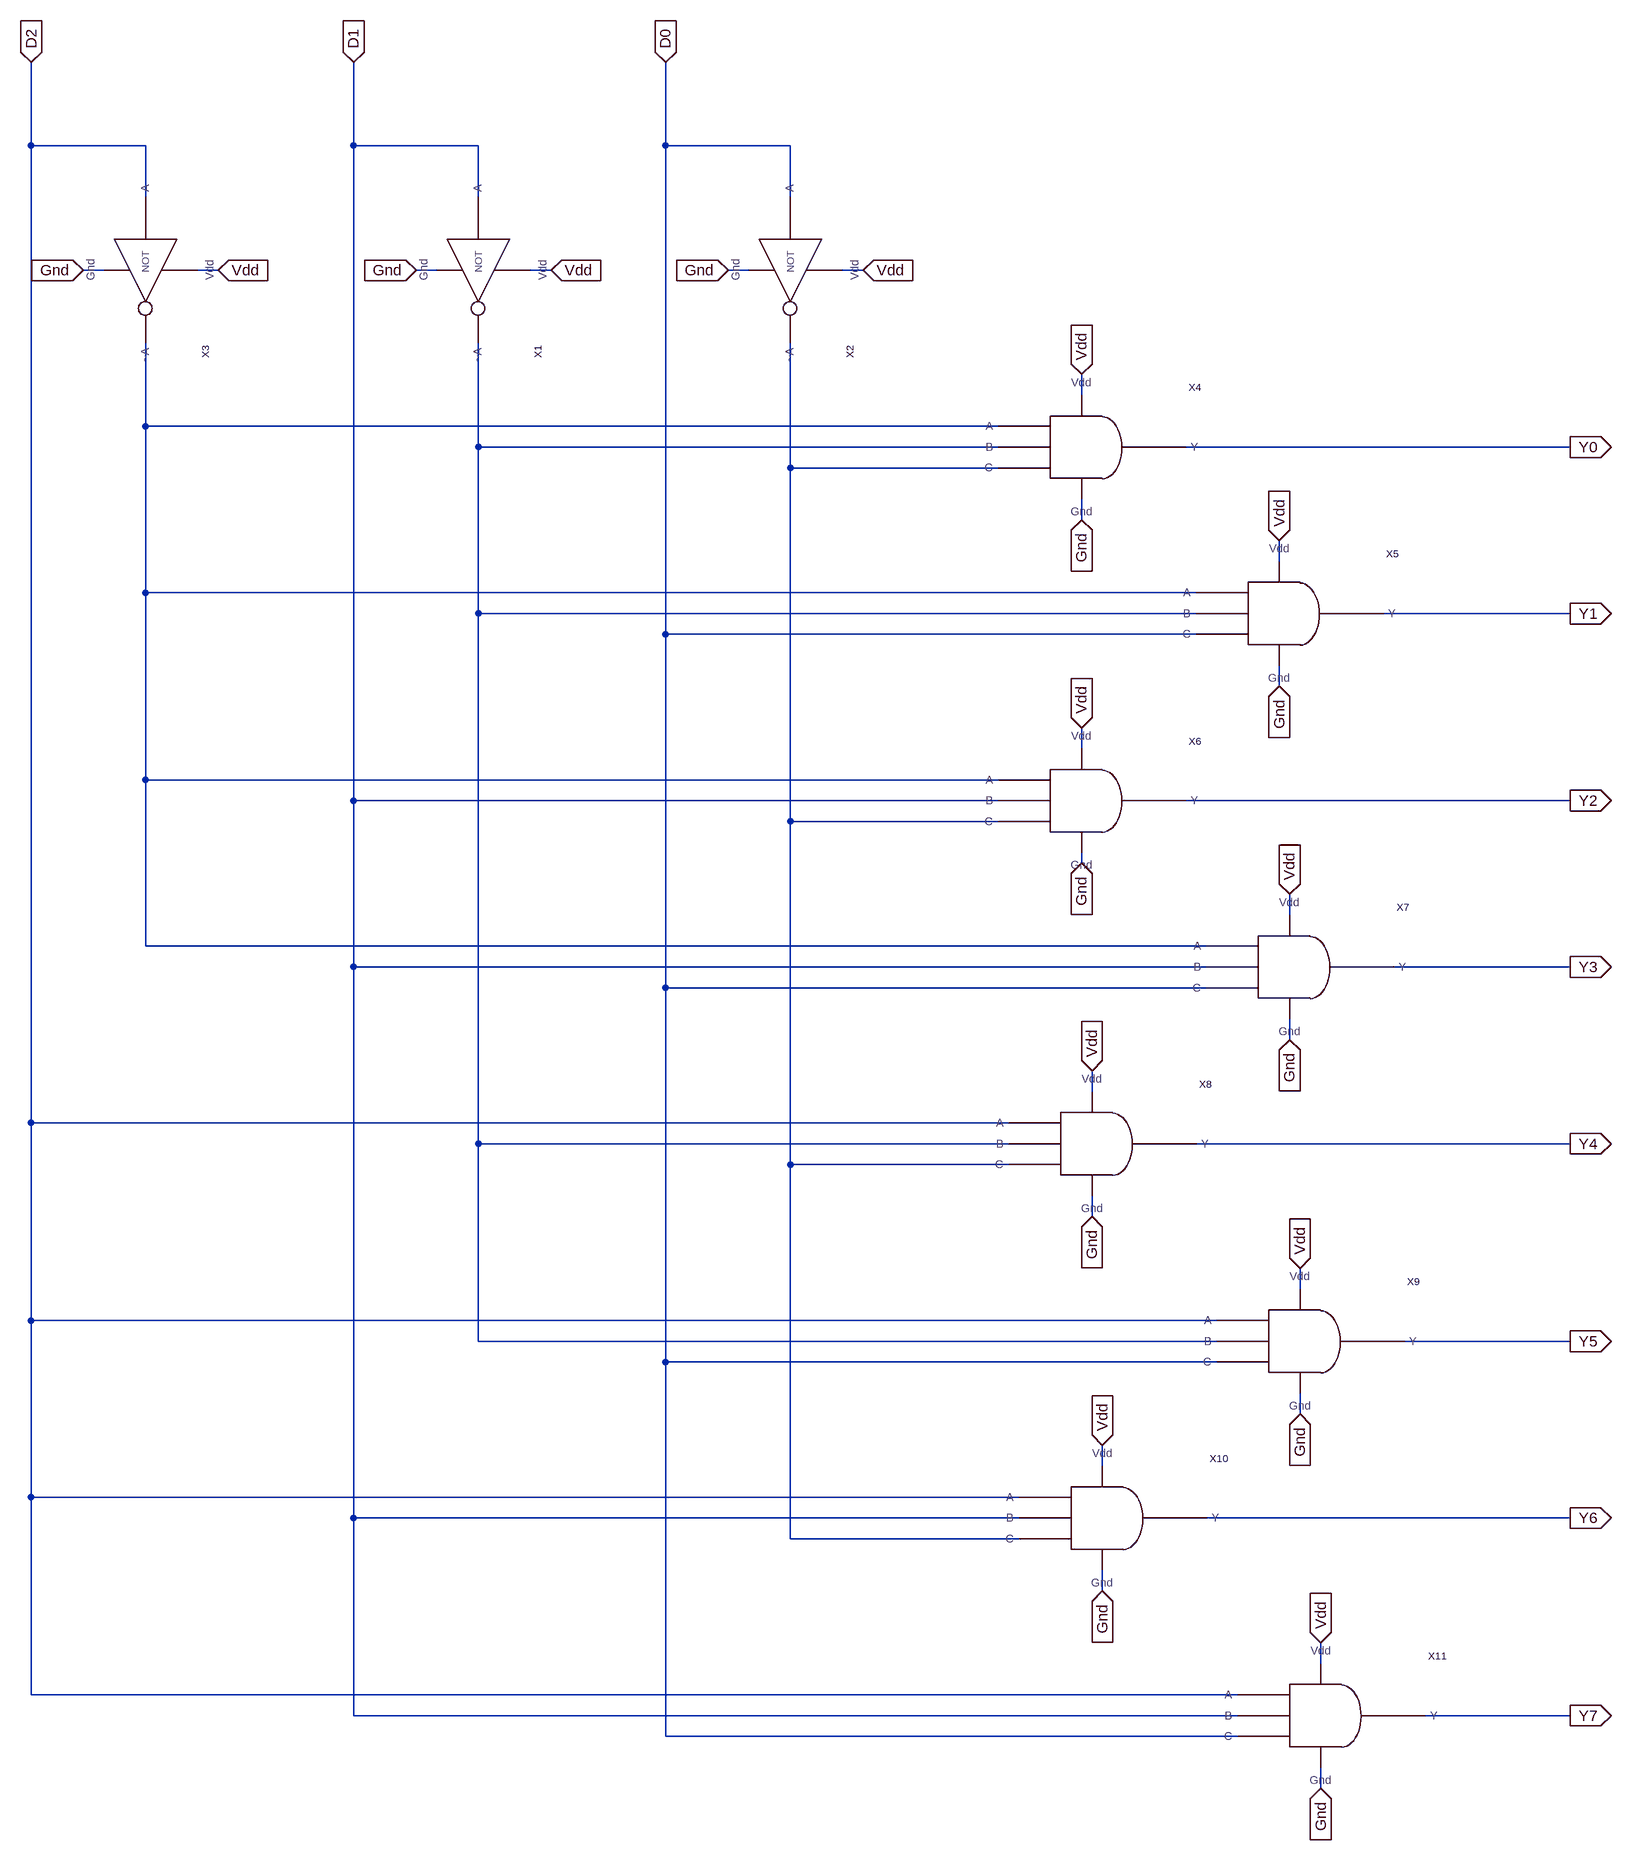
[diagram p0: schematic ALU_DEC.asc]
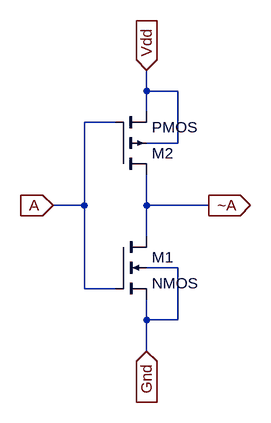
[diagram p1: sub-circuit not.asc]
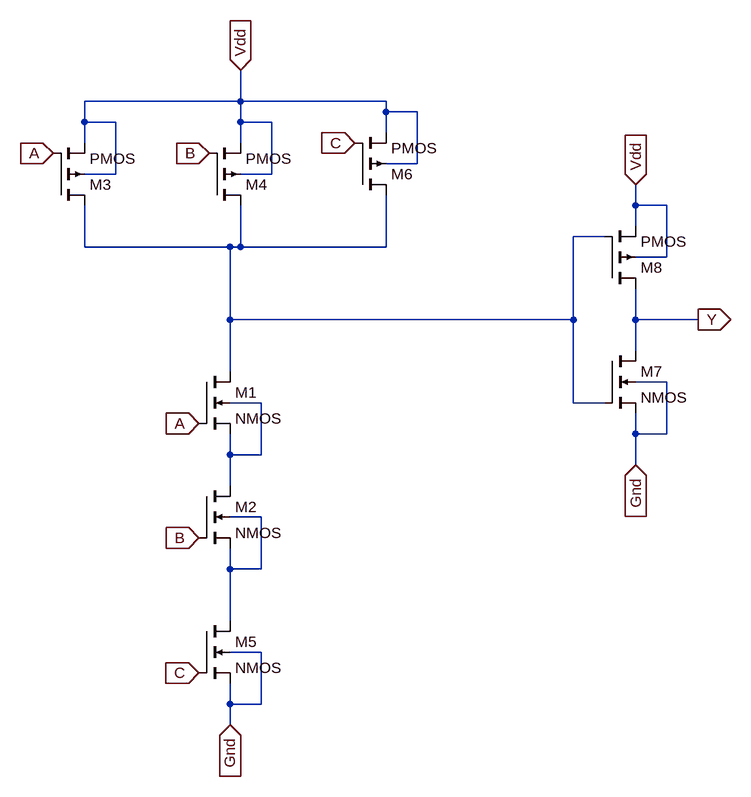
[diagram p2: sub-circuit 3iand.asc]
ALU_DEC.asc, the LTspice schematic file:
Version 4
SHEET 1 2024 2760
WIRE -640 -32 -640 -160
WIRE -464 -32 -640 -32
WIRE -144 -32 -144 -160
WIRE 48 -32 -144 -32
WIRE 336 -32 336 -160
WIRE 528 -32 336 -32
WIRE -464 48 -464 -32
WIRE 48 48 48 -32
WIRE 528 48 528 -32
WIRE -528 160 -560 160
WIRE -352 160 -384 160
WIRE -16 160 -48 160
WIRE 160 160 128 160
WIRE 464 160 432 160
WIRE 640 160 608 160
WIRE 976 352 976 320
WIRE -464 400 -464 272
WIRE 848 400 -464 400
WIRE 48 432 48 272
WIRE 848 432 48 432
WIRE 1728 432 1136 432
WIRE 528 464 528 272
WIRE 848 464 528 464
WIRE 976 544 976 512
WIRE 1280 608 1280 576
WIRE -464 656 -464 400
WIRE 1152 656 -464 656
WIRE 48 688 48 432
WIRE 1152 688 48 688
WIRE 1728 688 1440 688
WIRE 336 720 336 -32
WIRE 1152 720 336 720
WIRE 1280 800 1280 768
WIRE 976 896 976 864
WIRE -464 944 -464 656
WIRE 848 944 -464 944
WIRE -144 976 -144 -32
WIRE 848 976 -144 976
WIRE 1728 976 1136 976
WIRE 528 1008 528 464
WIRE 848 1008 528 1008
WIRE 976 1072 976 1056
WIRE 1296 1152 1296 1120
WIRE -464 1200 -464 944
WIRE 1168 1200 -464 1200
WIRE -144 1232 -144 976
WIRE 1168 1232 -144 1232
WIRE 1728 1232 1456 1232
WIRE 336 1264 336 720
WIRE 1168 1264 336 1264
WIRE 1296 1344 1296 1312
WIRE 992 1424 992 1392
WIRE -640 1472 -640 -32
WIRE 864 1472 -640 1472
WIRE 48 1504 48 688
WIRE 864 1504 48 1504
WIRE 1728 1504 1152 1504
WIRE 528 1536 528 1008
WIRE 864 1536 528 1536
WIRE 992 1616 992 1584
WIRE 1312 1728 1312 1696
WIRE -640 1776 -640 1472
WIRE 1184 1776 -640 1776
WIRE 48 1808 48 1504
WIRE 1184 1808 48 1808
WIRE 1728 1808 1472 1808
WIRE 336 1840 336 1264
WIRE 1184 1840 336 1840
WIRE 1312 1920 1312 1888
WIRE 1008 2000 1008 1968
WIRE -640 2048 -640 1776
WIRE 880 2048 -640 2048
WIRE -144 2080 -144 1232
WIRE 880 2080 -144 2080
WIRE 1728 2080 1168 2080
WIRE 528 2112 528 1536
WIRE 880 2112 528 2112
WIRE 1008 2192 1008 2160
WIRE 1344 2304 1344 2272
WIRE -640 2352 -640 2048
WIRE 1216 2352 -640 2352
WIRE -144 2384 -144 2080
WIRE 1216 2384 -144 2384
WIRE 1728 2384 1504 2384
WIRE 336 2416 336 1840
WIRE 1216 2416 336 2416
WIRE 1344 2496 1344 2464
FLAG 336 -160 D0
IOPIN 336 -160 In
FLAG -144 -160 D1
IOPIN -144 -160 In
FLAG -640 -160 D2
IOPIN -640 -160 In
FLAG 1344 2272 Vdd
IOPIN 1344 2272 In
FLAG 1008 1968 Vdd
IOPIN 1008 1968 In
FLAG 1312 1696 Vdd
IOPIN 1312 1696 In
FLAG 992 1392 Vdd
IOPIN 992 1392 In
FLAG 1296 1120 Vdd
IOPIN 1296 1120 In
FLAG 976 864 Vdd
IOPIN 976 864 In
FLAG 1280 576 Vdd
IOPIN 1280 576 In
FLAG 976 320 Vdd
IOPIN 976 320 In
FLAG 640 160 Vdd
IOPIN 640 160 In
FLAG 160 160 Vdd
IOPIN 160 160 In
FLAG -352 160 Vdd
IOPIN -352 160 In
FLAG 1728 432 Y0
IOPIN 1728 432 Out
FLAG 1728 688 Y1
IOPIN 1728 688 Out
FLAG 1728 976 Y2
IOPIN 1728 976 Out
FLAG 1728 1232 Y3
IOPIN 1728 1232 Out
FLAG 1728 1504 Y4
IOPIN 1728 1504 Out
FLAG 1728 1808 Y5
IOPIN 1728 1808 Out
FLAG 1728 2080 Y6
IOPIN 1728 2080 Out
FLAG 1728 2384 Y7
IOPIN 1728 2384 Out
FLAG -560 160 Gnd
IOPIN -560 160 In
FLAG -48 160 Gnd
IOPIN -48 160 In
FLAG 432 160 Gnd
IOPIN 432 160 In
FLAG 976 544 Gnd
IOPIN 976 544 In
FLAG 1280 800 Gnd
IOPIN 1280 800 In
FLAG 1296 1344 Gnd
IOPIN 1296 1344 In
FLAG 976 1072 Gnd
IOPIN 976 1072 In
FLAG 992 1616 Gnd
IOPIN 992 1616 In
FLAG 1312 1920 Gnd
IOPIN 1312 1920 In
FLAG 1008 2192 Gnd
IOPIN 1008 2192 In
FLAG 1344 2496 Gnd
IOPIN 1344 2496 In
SYMBOL NOT 64 160 R90
SYMATTR InstName X1
SYMBOL NOT 544 160 R90
SYMATTR InstName X2
SYMBOL NOT -448 160 R90
SYMATTR InstName X3
SYMBOL 3iAND 976 416 R0
SYMATTR InstName X4
SYMBOL 3iAND 1280 672 R0
SYMATTR InstName X5
SYMBOL 3iAND 976 960 R0
SYMATTR InstName X6
SYMBOL 3iAND 1296 1216 R0
SYMATTR InstName X7
SYMBOL 3iAND 992 1488 R0
SYMATTR InstName X8
SYMBOL 3iAND 1312 1792 R0
SYMATTR InstName X9
SYMBOL 3iAND 1008 2064 R0
SYMATTR InstName X10
SYMBOL 3iAND 1344 2368 R0
SYMATTR InstName X11

not.asc, the sub-circuit schematic file:
Version 4
SHEET 1 880 680
WIRE 304 -112 304 -144
WIRE 352 -112 304 -112
WIRE 304 -80 304 -112
WIRE 256 -64 208 -64
WIRE 352 -32 352 -112
WIRE 352 -32 304 -32
WIRE 208 64 208 -64
WIRE 208 64 160 64
WIRE 304 64 304 16
WIRE 400 64 304 64
WIRE 304 112 304 64
WIRE 352 160 304 160
WIRE 208 192 208 64
WIRE 256 192 208 192
WIRE 304 240 304 208
WIRE 352 240 352 160
WIRE 352 240 304 240
WIRE 304 288 304 240
FLAG 304 -144 Vdd
IOPIN 304 -144 In
FLAG 160 64 A
IOPIN 160 64 In
FLAG 400 64 ~A
IOPIN 400 64 Out
FLAG 304 288 Gnd
IOPIN 304 288 In
SYMBOL nmos4 256 112 R0
SYMATTR InstName M1
SYMBOL pmos4 256 16 M180
SYMATTR InstName M2

3iand.asc, the sub-circuit schematic file:
Version 4
SHEET 1 1036 936
WIRE 240 -128 240 -176
WIRE 240 -128 0 -128
WIRE 464 -128 240 -128
WIRE 464 -112 464 -128
WIRE 512 -112 464 -112
WIRE 0 -96 0 -128
WIRE 48 -96 0 -96
WIRE 240 -96 240 -128
WIRE 288 -96 240 -96
WIRE 464 -80 464 -112
WIRE 0 -64 0 -96
WIRE 240 -64 240 -96
WIRE 512 -32 512 -112
WIRE 512 -32 464 -32
WIRE 48 -16 48 -96
WIRE 48 -16 0 -16
WIRE 288 -16 288 -96
WIRE 288 -16 240 -16
WIRE 848 32 848 0
WIRE 896 32 848 32
WIRE 848 64 848 32
WIRE 800 80 752 80
WIRE 0 96 0 32
WIRE 224 96 0 96
WIRE 240 96 240 32
WIRE 240 96 224 96
WIRE 464 96 464 16
WIRE 464 96 240 96
WIRE 896 112 896 32
WIRE 896 112 848 112
WIRE 224 208 224 96
WIRE 752 208 752 80
WIRE 752 208 224 208
WIRE 848 208 848 160
WIRE 944 208 848 208
WIRE 848 256 848 208
WIRE 224 288 224 208
WIRE 896 304 848 304
WIRE 272 336 224 336
WIRE 752 336 752 208
WIRE 800 336 752 336
WIRE 848 384 848 352
WIRE 896 384 896 304
WIRE 896 384 848 384
WIRE 224 416 224 384
WIRE 272 416 272 336
WIRE 272 416 224 416
WIRE 848 432 848 384
WIRE 224 464 224 416
WIRE 272 512 224 512
WIRE 224 592 224 560
WIRE 272 592 272 512
WIRE 272 592 224 592
WIRE 224 672 224 592
WIRE 272 720 224 720
WIRE 224 800 224 768
WIRE 272 800 272 720
WIRE 272 800 224 800
WIRE 224 832 224 800
FLAG 176 544 B
IOPIN 176 544 In
FLAG 176 368 A
IOPIN 176 368 In
FLAG -48 -48 A
IOPIN -48 -48 In
FLAG 192 -48 B
IOPIN 192 -48 In
FLAG 240 -176 Vdd
IOPIN 240 -176 In
FLAG 176 752 C
IOPIN 176 752 In
FLAG 416 -64 C
IOPIN 416 -64 In
FLAG 224 832 Gnd
IOPIN 224 832 In
FLAG 848 0 Vdd
IOPIN 848 0 In
FLAG 848 432 Gnd
IOPIN 848 432 In
FLAG 944 208 Y
IOPIN 944 208 Out
SYMBOL nmos4 176 288 R0
SYMATTR InstName M1
SYMBOL nmos4 176 464 R0
SYMATTR InstName M2
SYMBOL pmos4 -48 32 M180
SYMATTR InstName M3
SYMBOL pmos4 192 32 M180
SYMATTR InstName M4
SYMBOL nmos4 176 672 R0
SYMATTR InstName M5
SYMBOL pmos4 416 16 M180
SYMATTR InstName M6
SYMBOL nmos4 800 256 R0
SYMATTR InstName M7
SYMBOL pmos4 800 160 M180
SYMATTR InstName M8

The netlist it stands for:
* ALU_DEC.asc
XX1 D1 N002 Vdd Gnd not
XX2 D0 N003 Vdd Gnd not
XX3 D2 N001 Vdd Gnd not
XX4 N001 N002 N003 Vdd Gnd Y0 3iand
XX5 N001 N002 D0 Vdd Gnd Y1 3iand
XX6 N001 D1 N003 Vdd Gnd Y2 3iand
XX7 N001 D1 D0 Vdd Gnd Y3 3iand
XX8 D2 N002 N003 Vdd Gnd Y4 3iand
XX9 D2 N002 D0 Vdd Gnd Y5 3iand
XX10 D2 D1 N003 Vdd Gnd Y6 3iand
XX11 D2 D1 D0 Vdd Gnd Y7 3iand

* block symbol definitions
.subckt not A ~A Vdd Gnd
M1 ~A A Gnd Gnd NMOS
M2 ~A A Vdd Vdd PMOS
.ends not

.subckt 3iand A B C Vdd Gnd Y
M1 N001 A N002 N002 NMOS
M2 N002 B N003 N003 NMOS
M3 N001 A Vdd Vdd PMOS
M4 N001 B Vdd Vdd PMOS
M5 N003 C Gnd Gnd NMOS
M6 N001 C Vdd Vdd PMOS
M7 Y N001 Gnd Gnd NMOS
M8 Y N001 Vdd Vdd PMOS
.ends 3iand

.model NMOS NMOS
.model PMOS PMOS
.lib standard.mos
.backanno
.end